# Altium schematic sheet Sheet_1_2021-12-20.schdoc
size 49 x 28 mm
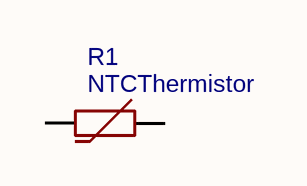
[diagram p0: Sheet_1_2021-12-20.schdoc]

## Parts
R1  NTCThermistor  [R0402]

## Nets

Not connected (* = marked no-connect by the designer): R1 1 2

## Library data of the parts
R1 = NTCThermistor: BOM_Manufacturer: MuRata; BOM_Manufacturer Part: NCP15XH103F03RC; nameAlias: Value; BOM_Supplier: LCSC; BOM_Supplier Part: C77131; BOM_JLCPCB Part Class: Extended Part; spicePre: R; spiceSymbolName: NCP15XH103F03RC